# Altium schematic sheet HEAT.SchDoc
size A4
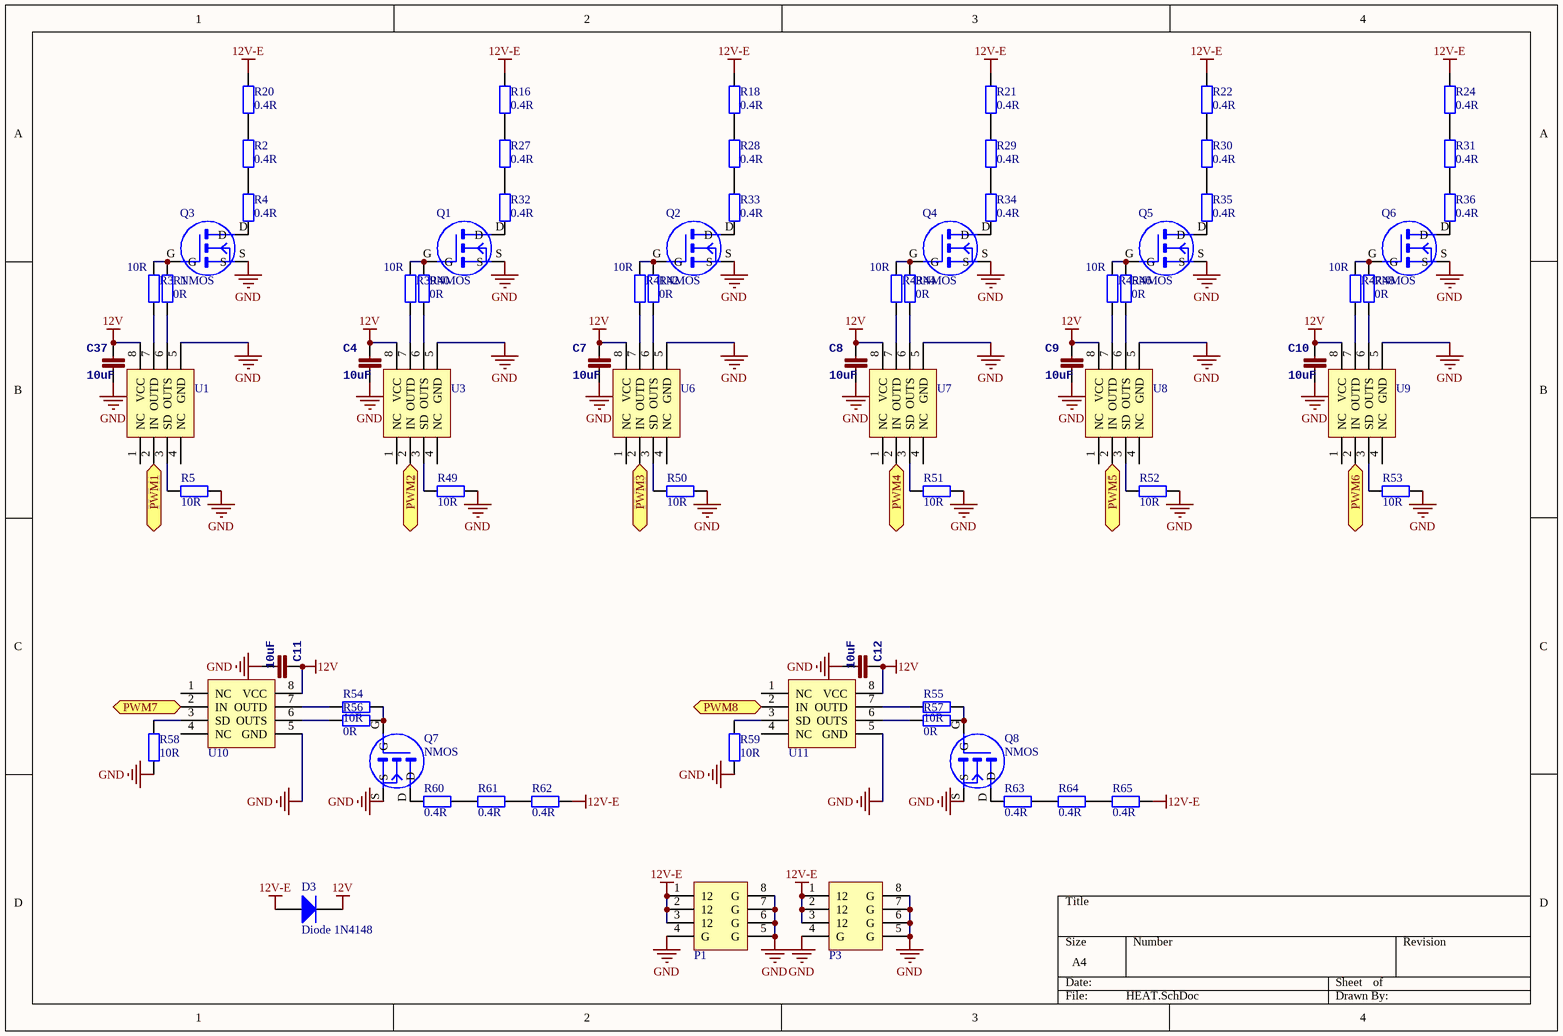
[diagram p0: HEAT.SchDoc]

## Parts
C4  10uF  [0805]
C7  10uF  [0805]
C8  10uF  [0805]
C9  10uF  [0805]
C10  10uF  [0805]
C11  10uF  [0805]
C12  10uF  [0805]
C37  10uF  [0805]
D3  Diode 1N4148  [LC-SOD-323]
P1  PCIE-8P  [PCIE_8PIN]  (value not drawn)
P3  PCIE-8P  [PCIE_8PIN]  (value not drawn)
Q1  NMOS  [BSC025N03MS]
Q2  NMOS  [BSC025N03MS]
Q3  NMOS  [BSC025N03MS]
Q4  NMOS  [BSC025N03MS]
Q5  NMOS  [BSC025N03MS]
Q6  NMOS  [BSC025N03MS]
Q7  NMOS  [BSC025N03MS]
Q8  NMOS  [BSC025N03MS]
R1  0R  [0402]
R2  0.4R  [2512]
R3  10R  [0402]
R4  0.4R  [2512]
R5  10R  [0402]
R16  0.4R  [2512]
R18  0.4R  [2512]
R20  0.4R  [2512]
R21  0.4R  [2512]
R22  0.4R  [2512]
R24  0.4R  [2512]
R27  0.4R  [2512]
R28  0.4R  [2512]
R29  0.4R  [2512]
R30  0.4R  [2512]
R31  0.4R  [2512]
R32  0.4R  [2512]
R33  0.4R  [2512]
R34  0.4R  [2512]
R35  0.4R  [2512]
R36  0.4R  [2512]
R39  10R  [0402]
R40  0R  [0402]
R41  10R  [0402]
R42  0R  [0402]
R43  10R  [0402]
R44  0R  [0402]
R45  10R  [0402]
R46  0R  [0402]
R47  10R  [0402]
R48  0R  [0402]
R49  10R  [0402]
R50  10R  [0402]
R51  10R  [0402]
R52  10R  [0402]
R53  10R  [0402]
R54  10R  [0402]
R55  10R  [0402]
R56  0R  [0402]
R57  0R  [0402]
R58  10R  [0402]
R59  10R  [0402]
R60  0.4R  [2512]
R61  0.4R  [2512]
R62  0.4R  [2512]
R63  0.4R  [2512]
R64  0.4R  [2512]
R65  0.4R  [2512]
U1  EG2131  [SO8]  (value not drawn)
U3  EG2131  [SO8]  (value not drawn)
U6  EG2131  [SO8]  (value not drawn)
U7  EG2131  [SO8]  (value not drawn)
U8  EG2131  [SO8]  (value not drawn)
U9  EG2131  [SO8]  (value not drawn)
U10  EG2131  [SO8]  (value not drawn)
U11  EG2131  [SO8]  (value not drawn)

## Ports
PWM1, PWM2, PWM3, PWM4, PWM5, PWM6, PWM7, PWM8

## Nets
12V: C4.2 C7.2 C8.2 C9.2 C10.2 C11.2 C12.2 C37.2 D3.2(K) U1.8(VCC) U3.8(VCC) U6.8(VCC) U7.8(VCC) U8.8(VCC) U9.8(VCC) U10.8(VCC) U11.8(VCC)
12V-E: D3.1(A) P1.1(12) P1.2(12) P1.3(12) P3.1(12) P3.2(12) P3.3(12) R16.1 R18.1 R20.1 R21.1 R22.1 R24.1 R62.1 R65.1
GND: C4.1 C7.1 C8.1 C9.1 C10.1 C11.1 C12.1 C37.1 P1.4(G) P1.5(G) P1.6(G) P1.7(G) P1.8(G) P3.4(G) P3.5(G) P3.6(G) P3.7(G) P3.8(G) Q1.S Q2.S Q3.S Q4.S Q5.S Q6.S Q7.S Q8.S R5.2 R49.2 R50.2 R51.2 R52.2 R53.2 R58.2 R59.2 U1.5(GND) U3.5(GND) U6.5(GND) U7.5(GND) U8.5(GND) U9.5(GND) U10.5(GND) U11.5(GND)
PWM1: U1.2(IN) ; port PWM1
PWM2: U3.2(IN) ; port PWM2
PWM3: U6.2(IN) ; port PWM3
PWM4: U7.2(IN) ; port PWM4
PWM5: U8.2(IN) ; port PWM5
PWM6: U9.2(IN) ; port PWM6
PWM7: U10.2(IN) ; port PWM7
PWM8: U11.2(IN) ; port PWM8
NetQ1_D: Q1.D R32.2
NetQ1_G: Q1.G R39.1 R40.1
NetQ2_D: Q2.D R33.2
NetQ2_G: Q2.G R41.1 R42.1
NetQ3_D: Q3.D R4.2
NetQ3_G: Q3.G R1.1 R3.1
NetQ4_D: Q4.D R34.2
NetQ4_G: Q4.G R43.1 R44.1
NetQ5_D: Q5.D R35.2
NetQ5_G: Q5.G R45.1 R46.1
NetQ6_D: Q6.D R36.2
NetQ6_G: Q6.G R47.1 R48.1
NetQ7_D: Q7.D R60.2
NetQ7_G: Q7.G R54.1 R56.1
NetQ8_D: Q8.D R63.2
NetQ8_G: Q8.G R55.1 R57.1
NetR1_2: R1.2 U1.6(OUTS)
NetR2_1: R2.1 R20.2
NetR2_2: R2.2 R4.1
NetR3_2: R3.2 U1.7(OUTD)
NetR5_1: R5.1 U1.3(SD)
NetR16_2: R16.2 R27.1
NetR18_2: R18.2 R28.1
NetR21_2: R21.2 R29.1
NetR22_2: R22.2 R30.1
NetR24_2: R24.2 R31.1
NetR27_2: R27.2 R32.1
NetR28_2: R28.2 R33.1
NetR29_2: R29.2 R34.1
NetR30_2: R30.2 R35.1
NetR31_2: R31.2 R36.1
NetR39_2: R39.2 U3.7(OUTD)
NetR40_2: R40.2 U3.6(OUTS)
NetR41_2: R41.2 U6.7(OUTD)
NetR42_2: R42.2 U6.6(OUTS)
NetR43_2: R43.2 U7.7(OUTD)
NetR44_2: R44.2 U7.6(OUTS)
NetR45_2: R45.2 U8.7(OUTD)
NetR46_2: R46.2 U8.6(OUTS)
NetR47_2: R47.2 U9.7(OUTD)
NetR48_2: R48.2 U9.6(OUTS)
NetR49_1: R49.1 U3.3(SD)
NetR50_1: R50.1 U6.3(SD)
NetR51_1: R51.1 U7.3(SD)
NetR52_1: R52.1 U8.3(SD)
NetR53_1: R53.1 U9.3(SD)
NetR54_2: R54.2 U10.7(OUTD)
NetR55_2: R55.2 U11.7(OUTD)
NetR56_2: R56.2 U10.6(OUTS)
NetR57_2: R57.2 U11.6(OUTS)
NetR58_1: R58.1 U10.3(SD)
NetR59_1: R59.1 U11.3(SD)
NetR60_1: R60.1 R61.2
NetR61_1: R61.1 R62.2
NetR63_1: R63.1 R64.2
NetR64_1: R64.1 R65.2

Not connected (* = marked no-connect by the designer): U1 1(NC) 4(NC); U3 1(NC) 4(NC); U6 1(NC) 4(NC); U7 1(NC) 4(NC); U8 1(NC) 4(NC); U9 1(NC) 4(NC); U10 1(NC) 4(NC); U11 1(NC) 4(NC)

## Library data of the parts
C4 C7-C12 C37 = CAP0402-CAP: <b>Capacitor</b> / Standard 0603 ceramic capacitor, and 0.1" leaded capacitor.; PARTNO: CC0402ZRY5V7BB104
D3 = Diode 1N4148: High Conductance Fast Diode; Published: 8-Jun-2000; LatestRevisionDate: 17-Jul-2002; LatestRevisionNote: Re-released for DXP Platform.; DatasheetVersion: 1997; PackageReference: DO-35; Publisher: Altium Limited; PackageDescription: Diode, Axial; Body 3.8 x 1.9 mm (LxDia. max), Lead Dia. 0.53 mm (max); Code_JEDEC: DO-204-AH; ComponentLink1Description: Manufacturer Link; ComponentLink1URL: http://www.fairchildsemi.com/; ComponentLink2Description: Datasheet; ComponentLink2URL: http://www.fairchildsemi.com/ds/1N%2F1N4148.pdf
R1 R3 R5 R39-R59 = Res2: Resistor; Value: 0Ohm; Published: 8-Jun-2000; LatestRevisionDate: 17-Jul-2002; LatestRevisionNote: Re-released for DXP Platform.; PackageReference: AXIAL-0.4; Publisher: Altium Limited; PackageDescription: Axial Device, Thru-Hole; 2 Leads; 0.4 in Pin Spacing
R2 R4 R16 R18 R20-R22 R24 R27-R36 R60-R65 = Res2: 电阻; Value: 0Ohm; Published: 8-Jun-2000; LatestRevisionDate: 17-Jul-2002; LatestRevisionNote: Re-released for DXP Platform.; PackageReference: AXIAL-0.4; Publisher: Altium Limited; PackageDescription: Axial Device, Thru-Hole; 2 Leads; 0.4 in Pin Spacing